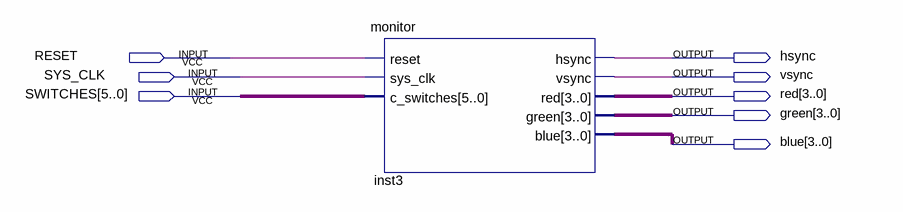
[diagram p0: schematic sheet]
// Quartus schematic Lab6.bdf as structural Verilog: 1 symbols, 8 pins
module Lab6 (
  input  RESET,
  input  SYS_CLK,
  input  [5:0] SWITCHES,
  output hsync,
  output vsync,
  output [3:0] red,
  output [3:0] green,
  output [3:0] blue
);

  monitor inst3 (
    .reset(RESET), .sys_clk(SYS_CLK), .c_switches(SWITCHES), .hsync(hsync), .vsync(vsync), .red(red),
    .green(green), .blue(blue));
endmodule
